# EAGLE design 16bit-v0_4 (EAGLE 7.2.0)
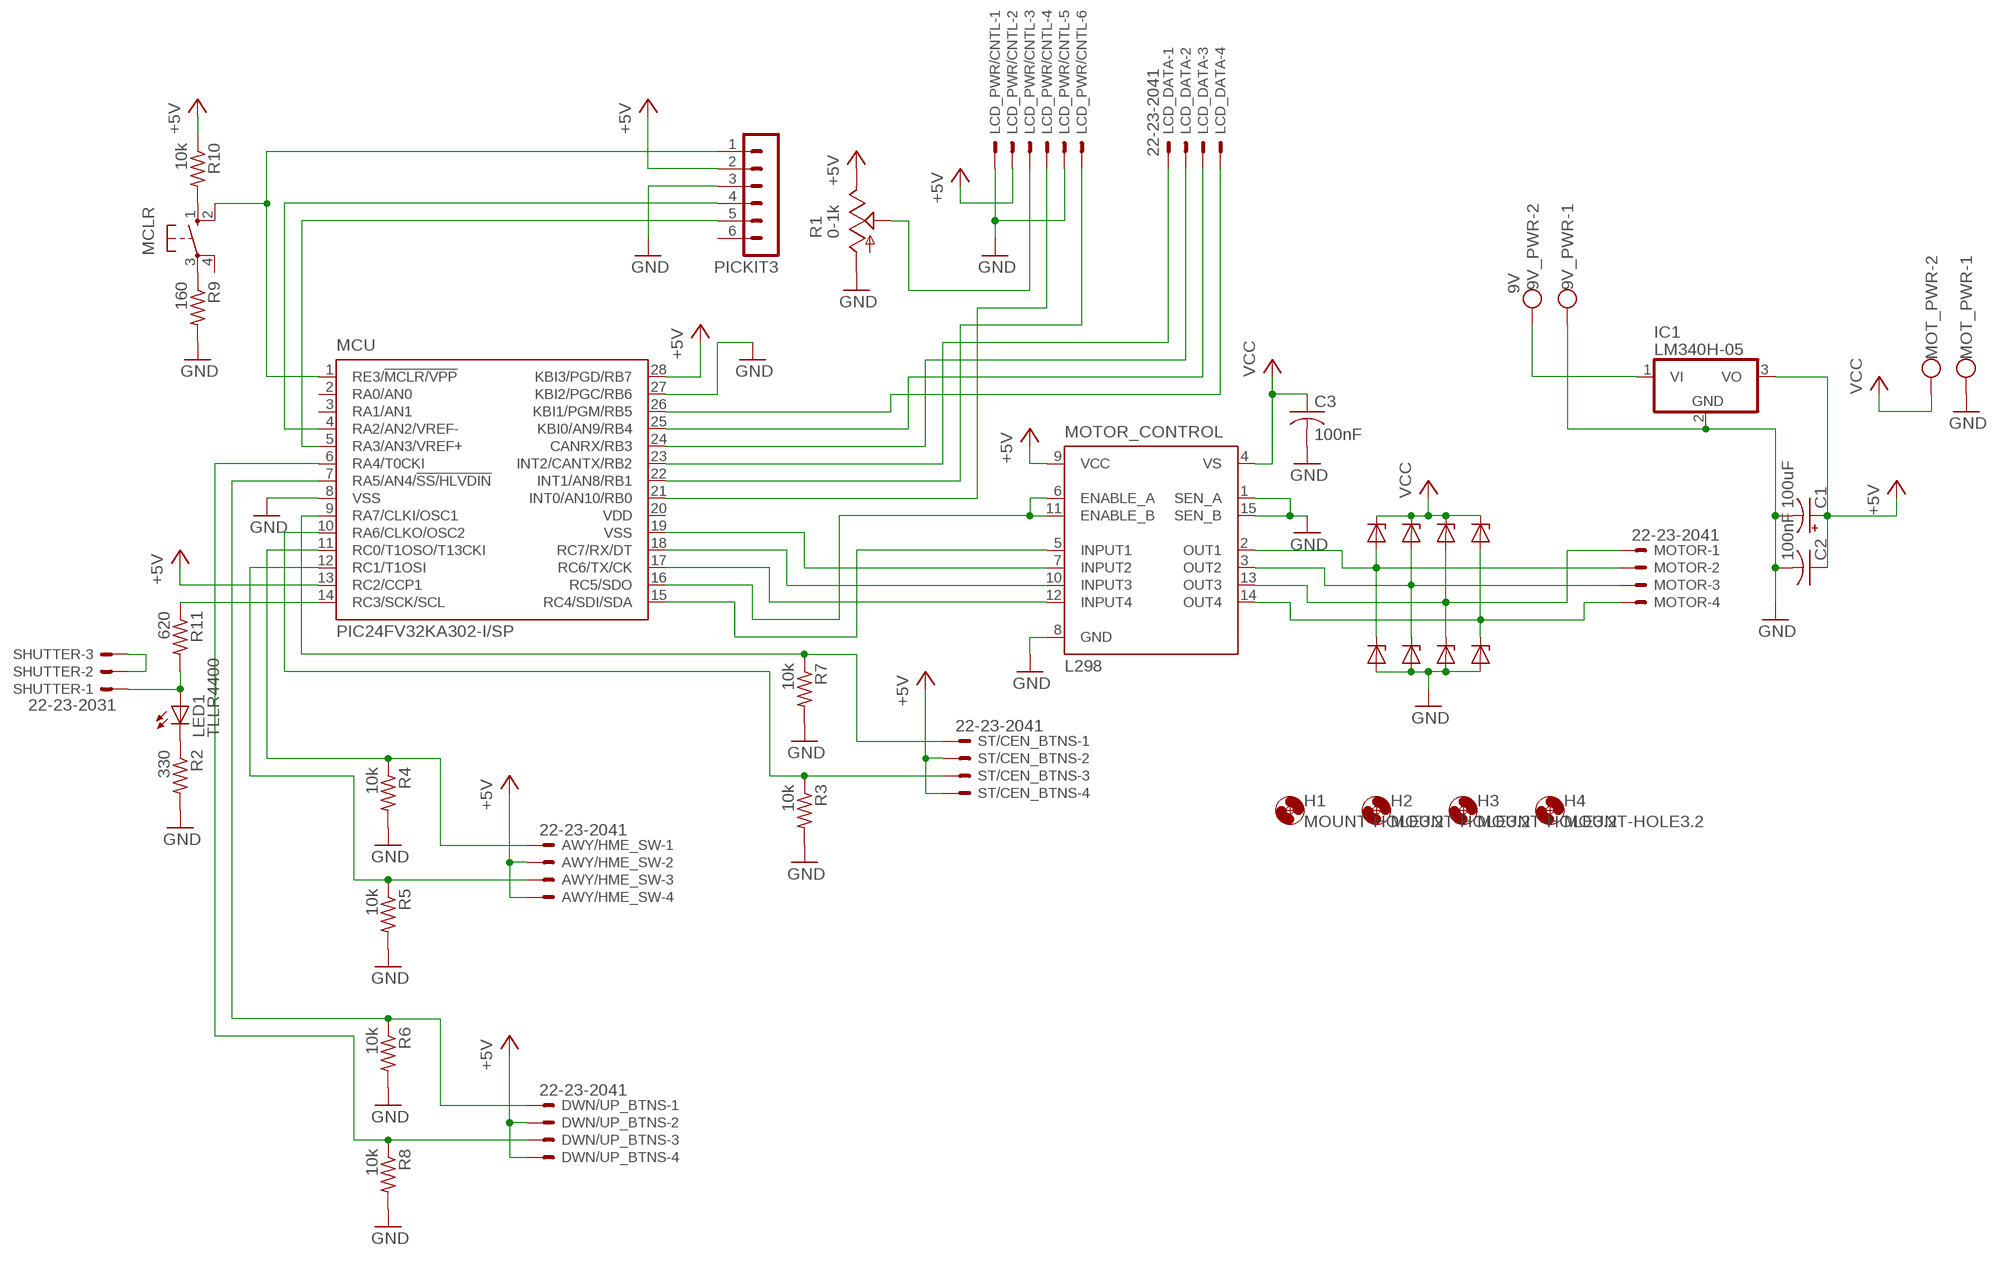
[diagram p0: schematic, sheet 1]

## Parts
9V_PWR  9V  W237-102  [W237-102]
AWY/HME_SW  22-23-2041  [22-23-2041]
C1  100uF  CPOL-USE2.5-7  [E2,5-7]
C2  100nF  C-US025-025X050  [C025-025X050]
C3  100nF  C-US025-025X050  [C025-025X050]
D1  BZX90  [DO34Z7]
D2  BZX90  [DO34Z7]
D3  BZX90  [DO34Z7]
D4  BZX90  [DO34Z7]
D5  BZX90  [DO34Z7]
D6  BZX90  [DO34Z7]
D7  BZX90  [DO34Z7]
D8  BZX90  [DO34Z7]
DWN/UP_BTNS  22-23-2041  [22-23-2041]
H1  MOUNT-HOLE3.2  [3,2]
H2  MOUNT-HOLE3.2  [3,2]
H3  MOUNT-HOLE3.2  [3,2]
H4  MOUNT-HOLE3.2  [3,2]
IC1  LM340H-05  [TO220H]
LCD_DATA  22-23-2041  [22-23-2041]
LCD_PWR/CNTL  22-23-2061  [22-23-2061]
LED1  TLLR4400  [LED3MM]
MCLR  10-XX  [B3F-10XX]
MCU  PIC18F2580-I/SP  [DIL28-3]
MOT_PWR  W237-102  [W237-102]
MOTOR  22-23-2041  [22-23-2041]
MOTOR_CONTROL  L298  [MULTIWATT-15]
PICKIT3  MA06-1  [MA06-1]
R1  0-1k  TRIM_US-B25P  [B25P]
R2  330  R-US_0207/7  [0207/7]
R3  10k  R-US_0207/7  [0207/7]
R4  10k  R-US_0207/7  [0207/7]
R5  10k  R-US_0207/7  [0207/7]
R6  10k  R-US_0207/7  [0207/7]
R7  10k  R-US_0207/7  [0207/7]
R8  10k  R-US_0207/7  [0207/7]
R9  160  R-US_0207/7  [0207/7]
R10  10k  R-US_0207/7  [0207/7]
R11  620  R-US_0207/7  [0207/7]
SHUTTER  22-23-2031  [22-23-2031]
ST/CEN_BTNS  22-23-2041  [22-23-2041]

## Nets
+5V: AWY/HME_SW.2 AWY/HME_SW.4 C1.+ C2.1 DWN/UP_BTNS.2 DWN/UP_BTNS.4 IC1.3(VO) LCD_PWR/CNTL.2 MCU.13(RC2/CCP1) MCU.28(KBI3/PGD/RB7) MOTOR_CONTROL.9(VCC) PICKIT3.2 R1.E R10.1 ST/CEN_BTNS.2 ST/CEN_BTNS.4
GND: 9V_PWR.1 C1.- C2.2 C3.2 D5.A D6.A D7.A D8.A IC1.2(GND) LCD_PWR/CNTL.1 LCD_PWR/CNTL.5 MCU.8(VSS) MCU.27(KBI2/PGC/RB6) MOT_PWR.1 MOTOR_CONTROL.8(GND) PICKIT3.3 R1.A R2.2 R3.2 R4.2 R5.2 R6.2 R7.2 R8.2 R9.2
N$1: MCLR.2(S1) MCU.1(RE3/!MCLR/VPP) PICKIT3.1
N$2: MCU.5(RA3/AN3/VREF+) PICKIT3.5
N$3: MCU.4(RA2/AN2/VREF-) PICKIT3.4
N$4: LED1.K(C) R2.1
N$5: MOTOR_CONTROL.1(SEN_A) MOTOR_CONTROL.15(SEN_B) ; supply symbol labelled GND
N$6: MCU.14(RC3/SCK/SCL) R11.1
N$7: MCU.16(RC5/SDO) MOTOR_CONTROL.6(ENABLE_A) MOTOR_CONTROL.11(ENABLE_B)
N$8: LCD_PWR/CNTL.3 R1.S
N$9: LCD_PWR/CNTL.4 MCU.21(INT0/AN10/RB0)
N$10: LCD_PWR/CNTL.6 MCU.22(INT1/AN8/RB1)
N$11: LCD_DATA.2 MCU.24(CANRX/RB3)
N$12: LCD_DATA.3 MCU.25(KBI0/AN9/RB4)
N$13: LCD_DATA.4 MCU.26(KBI1/PGM/RB5)
N$14: MCU.17(RC6/TX/CK) MOTOR_CONTROL.12(INPUT4)
N$15: AWY/HME_SW.1 MCU.11(RC0/T1OSO/T13CKI) R4.1
N$16: D2.A D6.C MOTOR.3 MOTOR_CONTROL.3(OUT2)
N$17: D3.A D7.C MOTOR.1 MOTOR_CONTROL.13(OUT3)
N$18: D4.A D8.C MOTOR.4 MOTOR_CONTROL.14(OUT4)
N$19: LED1.A R11.2 SHUTTER.1
N$20: LCD_DATA.1 MCU.23(INT2/CANTX/RB2)
N$21: MCU.10(RA6/CLKO/OSC2) R3.1 ST/CEN_BTNS.3
N$22: MCU.18(RC7/RX/DT) MOTOR_CONTROL.10(INPUT3)
N$23: DWN/UP_BTNS.1 MCU.7(RA5/AN4/!SS/HLVDIN) R6.1
N$24: MCU.9(RA7/CLKI/OSC1) R7.1 ST/CEN_BTNS.1
N$25: DWN/UP_BTNS.3 MCU.6(RA4/T0CKI) R8.1
N$26: MCU.19(VSS) MOTOR_CONTROL.7(INPUT2)
N$27: AWY/HME_SW.3 MCU.12(RC1/T1OSI) R5.1
N$28: D1.A D5.C MOTOR.2 MOTOR_CONTROL.2(OUT1)
N$29: MCU.15(RC4/SDI/SDA) MOTOR_CONTROL.5(INPUT1)
N$35: MCLR.1(S) R10.2
N$36: SHUTTER.2 SHUTTER.3
N$38: MCLR.3(P) R9.1
N$40: 9V_PWR.2 IC1.1(VI)
VCC: C3.1 D1.C D2.C D3.C D4.C MOT_PWR.2 MOTOR_CONTROL.4(VS)
Unconnected: MCLR.4(P1) MCU.2(RA0/AN0) MCU.3(RA1/AN1) PICKIT3.6

## Power pins joined to a net without a drawn wire
VDD: MCU.20(VDD)

## Library data of the parts
9V_PWR MOT_PWR = con-wago-500:W237-102: WAGO SCREW CLAMP; MPN: 237-102; OC_FARNELL: unknown; OC_NEWARK: 70K9898
AWY/HME_SW DWN/UP_BTNS LCD_DATA MOTOR ST/CEN_BTNS = con-molex:22-23-2041: .100" (2.54mm) Center Header - 4 Pin; MF: MOLEX; MPN: 22-23-2041; OC_FARNELL: 1462920; OC_NEWARK: 38C0355
C1 = rcl:CPOL-US: POLARIZED CAPACITOR, American symbol
C2 C3 = rcl:C-US: CAPACITOR, American symbol
D1-D8 = diode:BZX90: Z DIODE
H1-H4 = holes:MOUNT-HOLE: MOUNTING HOLE with drill center marker
IC1 = linear:LM340?-*: Positive VOLTAGE REGULATOR Source: http://cache.national.com/ds/LM/LM340.pdf
LCD_PWR/CNTL = con-molex:22-23-2061: .100" (2.54mm) Center Header - 6 Pin; MF: MOLEX; MPN: 22-23-2061; OC_FARNELL: 1462922; OC_NEWARK: 27C1933
LED1 = led:TLLR4400: Low Current (2mA) LED 3 mm Tinted Diffused Package color RED Source: Data sheet <http://www.farnell.com/datasheets/391100.pdf>; MF: VISHAY SEMICONDUCTOR; OC_FARNELL: 1612437
MCLR = switch-omron:10-XX: OMRON SWITCH; MPN: B3F-1000; OC_FARNELL: 176432; OC_NEWARK: 36M3542
MCU = microchip:PIC18F2*80: 28-Pin Enhanced Flash Microcontrollers with ECAN(TM) Technology 10-Bit A/D and nanoWatt Technology Source: http://www.microchip.com .. 39637a.pdf; MF: MICROCHIP; MPN: PIC24FV32KA302-I/SP; OC_FARNELL: 9321276; OC_NEWARK: 71J7244
MOTOR_CONTROL = st-microelectronics:L298: DUAL FULL-BRIDGE DRIVER; MPN: L298N; OC_FARNELL: 1589425; OC_NEWARK: 32M1527
PICKIT3 = con-lstb:MA06-1: PIN HEADER; OC_FARNELL: unknown; OC_NEWARK: unknown
R1 = pot:TRIM_US-: POTENTIOMETER
R2-R11 = resistor:R-US_: RESISTOR, American symbol
SHUTTER = con-molex:22-23-2031: .100" (2.54mm) Center Header - 3 Pin; MF: MOLEX; MPN: 22-23-2031; OC_FARNELL: 1462950; OC_NEWARK: 30C0862

## Board
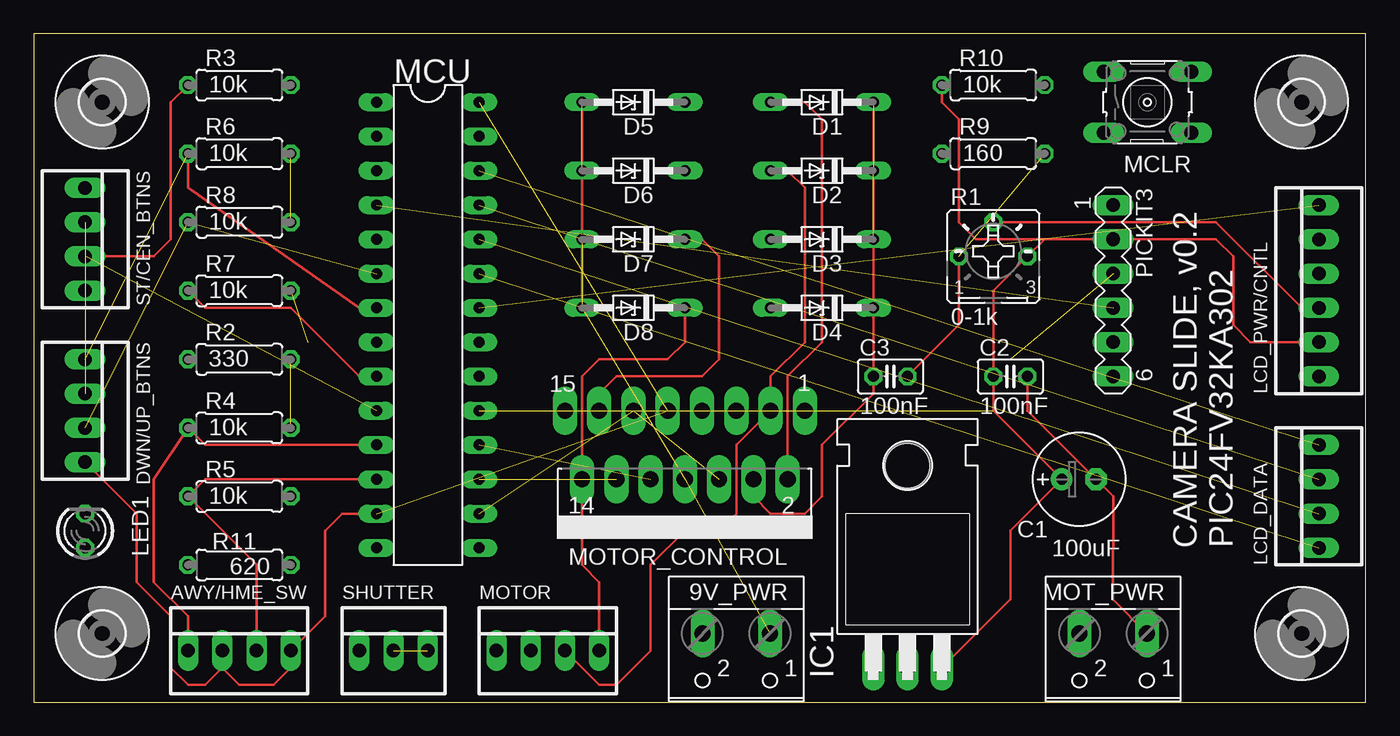
[diagram p1: board, top side]
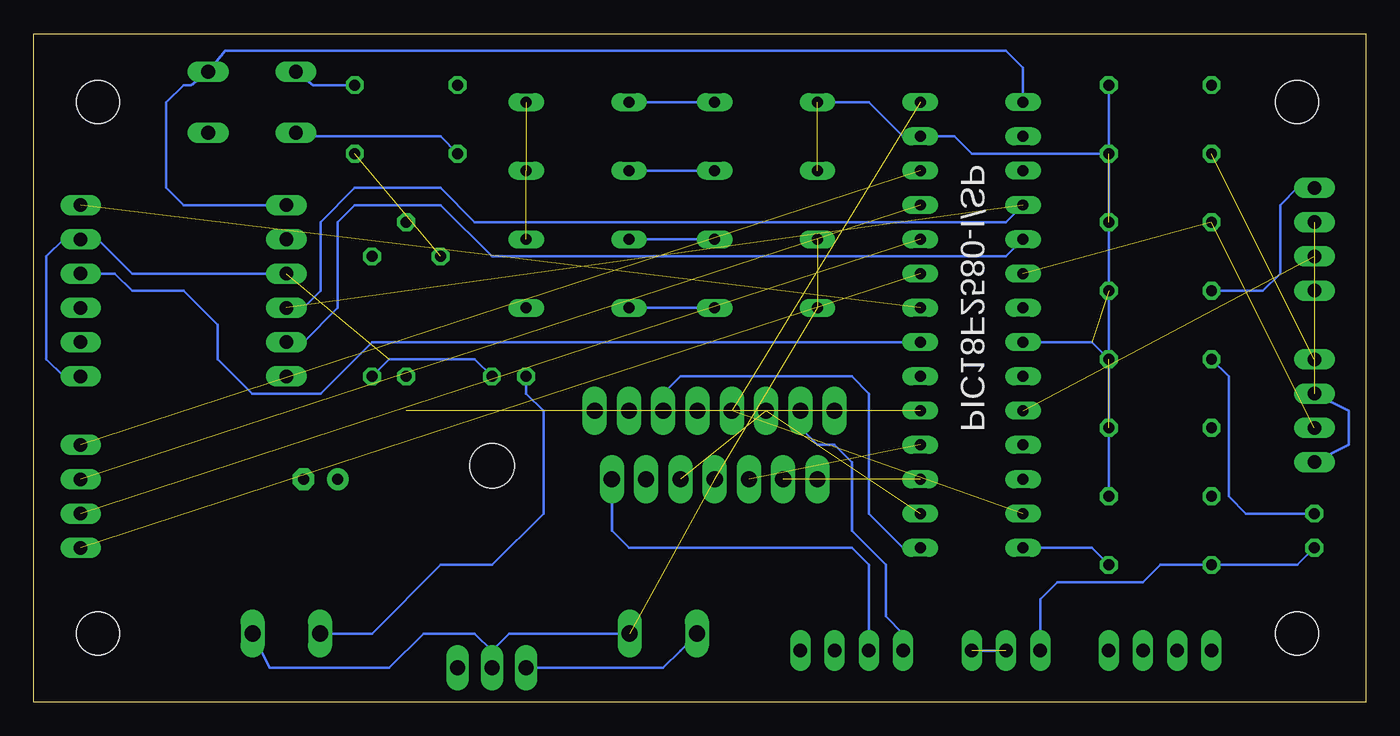
[diagram p2: board, bottom side, seen from below]

Size 98.73 x 49.52 mm. Coordinates in mm from the lower left corner, seen from the top.
Outline: 0,0 98.73,0 98.73,49.52 0,49.52 0,0
Copper layers (1*16): Top 0.035mm / dielectric 1.5mm / Bottom 0.035mm
Design rules "ITEADstudio_DRC": minimum track width 6mil, minimum drill 12mil, track to track 6mil, track to pad 6mil, pad to pad 6mil, via to via 6mil, smd to smd 0mil, copper to edge 10mil, drill to drill 10mil, minimum pad ring 10mil, minimum via ring 6mil, stop-mask expansion 2mil, vias tented up to drill 100mil, thermal gap 10mil

### Footprints (pad centres in the part's own frame; a part is rotated, then mirrored left to right if it is on the bottom)
W237-102 = drill 1.194 long: 1 -2.5,-1.27; 2 2.5,-1.27
22-23-2041 = drill 1 long: 1 -3.81,0; 2 -1.27,0; 3 1.27,0; 4 3.81,0
E2,5-7 = drill 0.813 pad 1.6: + -1.27,0 | drill 0.813 pad 1.6 octagon: - 1.27,0
C025-025X050 = drill 0.813 octagon: 1 -1.27,0; 2 1.27,0
DO34Z7 = drill 0.813 long: A 3.81,0; C -3.81,0
3,2 = hole 3.2: 0,0
TO220H = drill 1.118 long: 1 -2.54,-10.16; 2 0,-10.16; 3 2.54,-10.16 | hole 3.302: 0,4.826
22-23-2061 = drill 1 long: 1 -6.35,0; 2 -3.81,0; 3 -1.27,0; 4 1.27,0; 5 3.81,0; 6 6.35,0
LED3MM = drill 0.813 octagon: A -1.27,0; K 1.27,0
B3F-10XX = drill 1.016 long: 1 -3.251,2.261; 2 3.251,2.261; 3 -3.251,-2.261; 4 3.251,-2.261
DIL28-3 = drill 0.813 long: 1 -16.51,-3.81; 2 -13.97,-3.81; 3 -11.43,-3.81; 4 -8.89,-3.81; 5 -6.35,-3.81; 6 -3.81,-3.81; 7 -1.27,-3.81; 8 1.27,-3.81; 9 3.81,-3.81; 10 6.35,-3.81; 11 8.89,-3.81; 12 11.43,-3.81; 13 13.97,-3.81; 14 16.51,-3.81; 15 16.51,3.81; 16 13.97,3.81; 17 11.43,3.81; 18 8.89,3.81; 19 6.35,3.81; 20 3.81,3.81; 21 1.27,3.81; 22 -1.27,3.81; 23 -3.81,3.81; 24 -6.35,3.81; 25 -8.89,3.81; 26 -11.43,3.81; 27 -13.97,3.81; 28 -16.51,3.81
MULTIWATT-15 = drill 1.2 long: 1 -8.89,-7.62; 2 -7.62,-2.54; 3 -6.35,-7.62; 4 -5.08,-2.54; 5 -3.81,-7.62; 6 -2.54,-2.54; 7 -1.27,-7.62; 8 0,-2.54; 9 1.27,-7.62; 10 2.54,-2.54; 11 3.81,-7.62; 12 5.08,-2.54; 13 6.35,-7.62; 14 7.62,-2.54; 15 8.89,-7.62
MA06-1 = drill 1.016 long: 1 -6.35,0; 2 -3.81,0; 3 -1.27,0; 4 1.27,0; 5 3.81,0; 6 6.35,0
B25P = drill 0.813 octagon: A -2.54,0; E 2.54,0; S 0,2.54
0207/7 = drill 0.813 octagon: 1 -3.81,0; 2 3.81,0
22-23-2031 = drill 1 long: 1 -2.54,0; 2 0,0; 3 2.54,0

### Placement (x,y rotation side)
9V_PWR  52.07,3.81 180 top
AWY/HME_SW  15.24,3.81 0 top
C1  77.47,16.51 0 top
C2  72.39,24.13 0 top
C3  63.5,24.13 0 top
D1  58.42,44.45 180 top
D2  58.42,39.37 180 top
D3  58.42,34.29 180 top
D4  58.42,29.21 180 top
D5  44.45,44.45 180 top
D6  44.45,39.37 180 top
D7  44.45,34.29 180 top
D8  44.45,29.21 180 top
DWN/UP_BTNS  3.81,21.59 270 top
H1  5.08,5.08 0 top
H2  5.08,44.45 0 top
H3  93.98,44.45 0 top
H4  93.98,5.08 0 top
IC1  64.77,12.7 0 top
LCD_DATA  95.25,15.24 90 top
LCD_PWR/CNTL  95.25,30.48 90 top
LED1  3.81,12.7 90 top
MCLR  82.55,44.45 0 top
MCU  29.21,27.94 270 top
MOT_PWR  80.01,3.81 180 top
MOTOR  38.1,3.81 0 top
MOTOR_CONTROL  48.26,13.97 180 top
PICKIT3  80.01,30.48 270 top
R1  71.12,33.02 0 top
R2  15.24,25.4 0 top
R3  15.24,45.72 0 top
R4  15.24,20.32 0 top
R5  15.24,15.24 0 top
R6  15.24,40.64 0 top
R7  15.24,30.48 0 top
R8  15.24,35.56 0 top
R9  71.12,40.64 0 top
R10  71.12,45.72 0 top
R11  15.24,10.16 180 top
SHUTTER  26.67,3.81 0 top
ST/CEN_BTNS  3.81,34.29 270 top

### Tracks (layer width: path | path; a pad name or v marks a point on that pad's centre or on a via)
+5V  (5 unrouted)
  Top 0.203: IC1.3 72.39,7.62 72.39,12.7 C1.+ 71.12,21.59 C2.1 71.12,30.48 R1.E 74.93,34.29 | MCU.13 22.86,13.97 21.59,12.7 21.59,6.35 AWY/HME_SW.4 19.05,2.54 17.78,1.27 15.24,1.27 13.97,2.54 | DWN/UP_BTNS.4 7.62,13.97 7.62,8.89 10.16,6.35 10.16,2.54 11.43,1.27 12.7,1.27 13.97,2.54 | 13.97,2.54 AWY/HME_SW.2 | 74.93,34.29 PICKIT3.2 87.63,34.29 88.9,33.02 88.9,27.94 90.17,26.67 LCD_PWR/CNTL.2 | R10.1 67.31,44.45 68.58,43.18 68.58,35.56 69.85,34.29 74.93,34.29
  Bottom 0.203: DWN/UP_BTNS.4 1.27,19.05 1.27,21.59 DWN/UP_BTNS.2
GND  (9 unrouted)
  Top 0.203: D5.A D8.A | C2.2 73.66,21.59 C1.- 80.01,15.24 79.97,7.62 MOT_PWR.1 | R1.A 68.58,27.94 C3.2
  Bottom 0.203: R5.2 R2.2 | R2.2 R6.2 | R6.2 R3.2 | R2.2 20.32,26.67 MCU.8 | D5.A 36.83,44.45 34.29,41.91 MCU.27 30.48,41.91 29.21,40.64 R6.2 | 9V_PWR.1 63.5,5.08 64.77,3.81 | 64.77,3.81 IC1.2 | C3.2 66.04,25.4 72.39,25.4 C2.2 | 64.77,3.81 66.04,5.08 69.85,5.08 72.39,2.54 81.24,2.54 MOT_PWR.1 | LCD_PWR/CNTL.1 96.52,24.13 97.79,25.4 97.79,33.02 96.52,34.29 LCD_PWR/CNTL.5 93.98,34.29 91.44,31.75 PICKIT3.3
N$1
  Bottom 0.203: MCU.1 25.4,46.99 26.67,48.26 84.53,48.26 MCLR.2 87.07,45.72 87.63,45.72 88.9,44.45 88.9,38.1 87.63,36.83 PICKIT3.1
N$2
  Bottom 0.203: MCU.5 26.67,33.02 64.77,33.02 68.58,36.83 74.93,36.83 76.2,35.56 76.2,29.21 78.74,26.67 PICKIT3.5
N$3  (1 unrouted)
  Bottom 0.203: MCU.4 26.67,35.56 66.04,35.56 68.58,38.1 74.93,38.1 77.47,35.56 77.47,30.48 78.74,29.21 PICKIT3.4
N$4
  Bottom 0.203: R2.1 10.16,24.13 10.16,15.24 8.89,13.97 LED1.K
N$5  (1 unrouted)
N$6
  Bottom 0.203: R11.1 20.32,11.43 MCU.14
N$7  (2 unrouted)
N$8
  Top 0.203: R1.S 87.63,35.56 93.98,29.21 LCD_PWR/CNTL.3
N$9
  Bottom 0.203: MCU.21 73.66,26.67 77.47,22.86 82.55,22.86 85.09,25.4 85.09,27.94 87.63,30.48 91.44,30.48 92.71,31.75 LCD_PWR/CNTL.4
N$10  (1 unrouted)
N$11  (1 unrouted)
N$12  (1 unrouted)
N$13  (1 unrouted)
N$14  (1 unrouted)
N$15
  Top 0.203: MCU.11 12.7,19.05 R4.1 8.89,16.51 8.89,8.89 11.43,6.35 AWY/HME_SW.1
N$16
  Top 0.203: D2.A 55.88,39.37 57.15,38.1 57.15,26.67 54.61,24.13 MOTOR_CONTROL.3 52.07,19.05 52.07,13.97 50.8,12.7 48.26,12.7 45.72,10.16 45.72,3.81 43.18,1.27 41.91,1.27 MOTOR.3
  Bottom 0.203: D6.C D2.A
N$17
  Top 0.203: D7.C 49.53,34.29 50.8,33.02 50.8,25.4 49.53,24.13 43.18,24.13 41.91,22.86 MOTOR_CONTROL.13
  Bottom 0.203: D7.C D3.A | MOTOR.1 34.29,5.08 35.56,6.35 35.56,10.16 38.1,12.7 38.1,17.78 39.37,19.05 40.64,19.05 41.91,20.32 MOTOR_CONTROL.13
N$18
  Top 0.203: D8.C 48.26,26.67 46.99,25.4 41.91,25.4 40.64,24.13 MOTOR_CONTROL.14 40.64,10.16 41.91,8.89 MOTOR.4
  Bottom 0.203: D8.C D4.A
N$19
  Bottom 0.203: LED1.A 5.08,10.16 R11.2 15.24,10.16 16.51,8.89 22.86,8.89 24.13,7.62 SHUTTER.1
N$20  (1 unrouted)
N$21  (1 unrouted)
  Top 0.203: R3.1 10.16,44.45 10.16,34.29 8.89,33.02 ST/CEN_BTNS.3
N$22  (1 unrouted)
N$23  (1 unrouted)
  Top 0.203: R6.1 11.43,38.1 24.13,29.21 MCU.7
N$24
  Top 0.203: R7.1 12.7,29.21 19.05,29.21 24.13,24.13 MCU.9
  Bottom 0.203: ST/CEN_BTNS.1 5.08,38.1 6.35,36.83 6.35,31.75 7.62,30.48 R7.1
N$25  (2 unrouted)
N$26  (1 unrouted)
N$27
  Top 0.203: MCU.12 12.7,16.51 R5.1 16.51,10.16 AWY/HME_SW.3
N$28
  Top 0.203: D1.A 57.15,44.45 58.42,43.18 58.42,26.67 55.88,24.13 MOTOR_CONTROL.2
  Bottom 0.203: D5.C D1.A | MOTOR.2 36.83,10.16 38.1,11.43 54.61,11.43 55.88,12.7 MOTOR_CONTROL.2
N$29
  Bottom 0.203: MCU.15 34.29,11.43 36.83,13.97 36.83,22.86 38.1,24.13 39.37,24.13 40.64,24.13 50.8,24.13 52.07,22.86 MOTOR_CONTROL.5
N$35
  Bottom 0.203: R10.2 78.03,45.72 MCLR.1
N$36  (1 unrouted)
  Bottom 0.203: SHUTTER.2 SHUTTER.3
N$38
  Bottom 0.203: R9.1 68.58,41.91 78.03,41.91 MCLR.3
N$40
  Bottom 0.203: 9V_PWR.2 50.8,3.81 52.07,2.54 IC1.1
VCC  (2 unrouted)
  Top 0.203: D1.C D4.C C3.1 62.23,22.86 58.42,19.05 58.42,15.24 57.15,13.97 54.61,13.97 53.34,15.24 MOTOR_CONTROL.4
  Bottom 0.203: MOT_PWR.2 73.66,5.08 68.58,10.16 64.77,10.16 60.96,13.97 60.96,21.59 62.23,22.86 C3.1

### Text on the board
tPlace: CAMERA SLIDE, v0.2 / PIC24FV32KA302